# Altium schematic sheet obc-v2_BOARD-CONNECT.SchDoc
size 420 x 297 mm; SheetNumber: 8; SheetTotal: 21
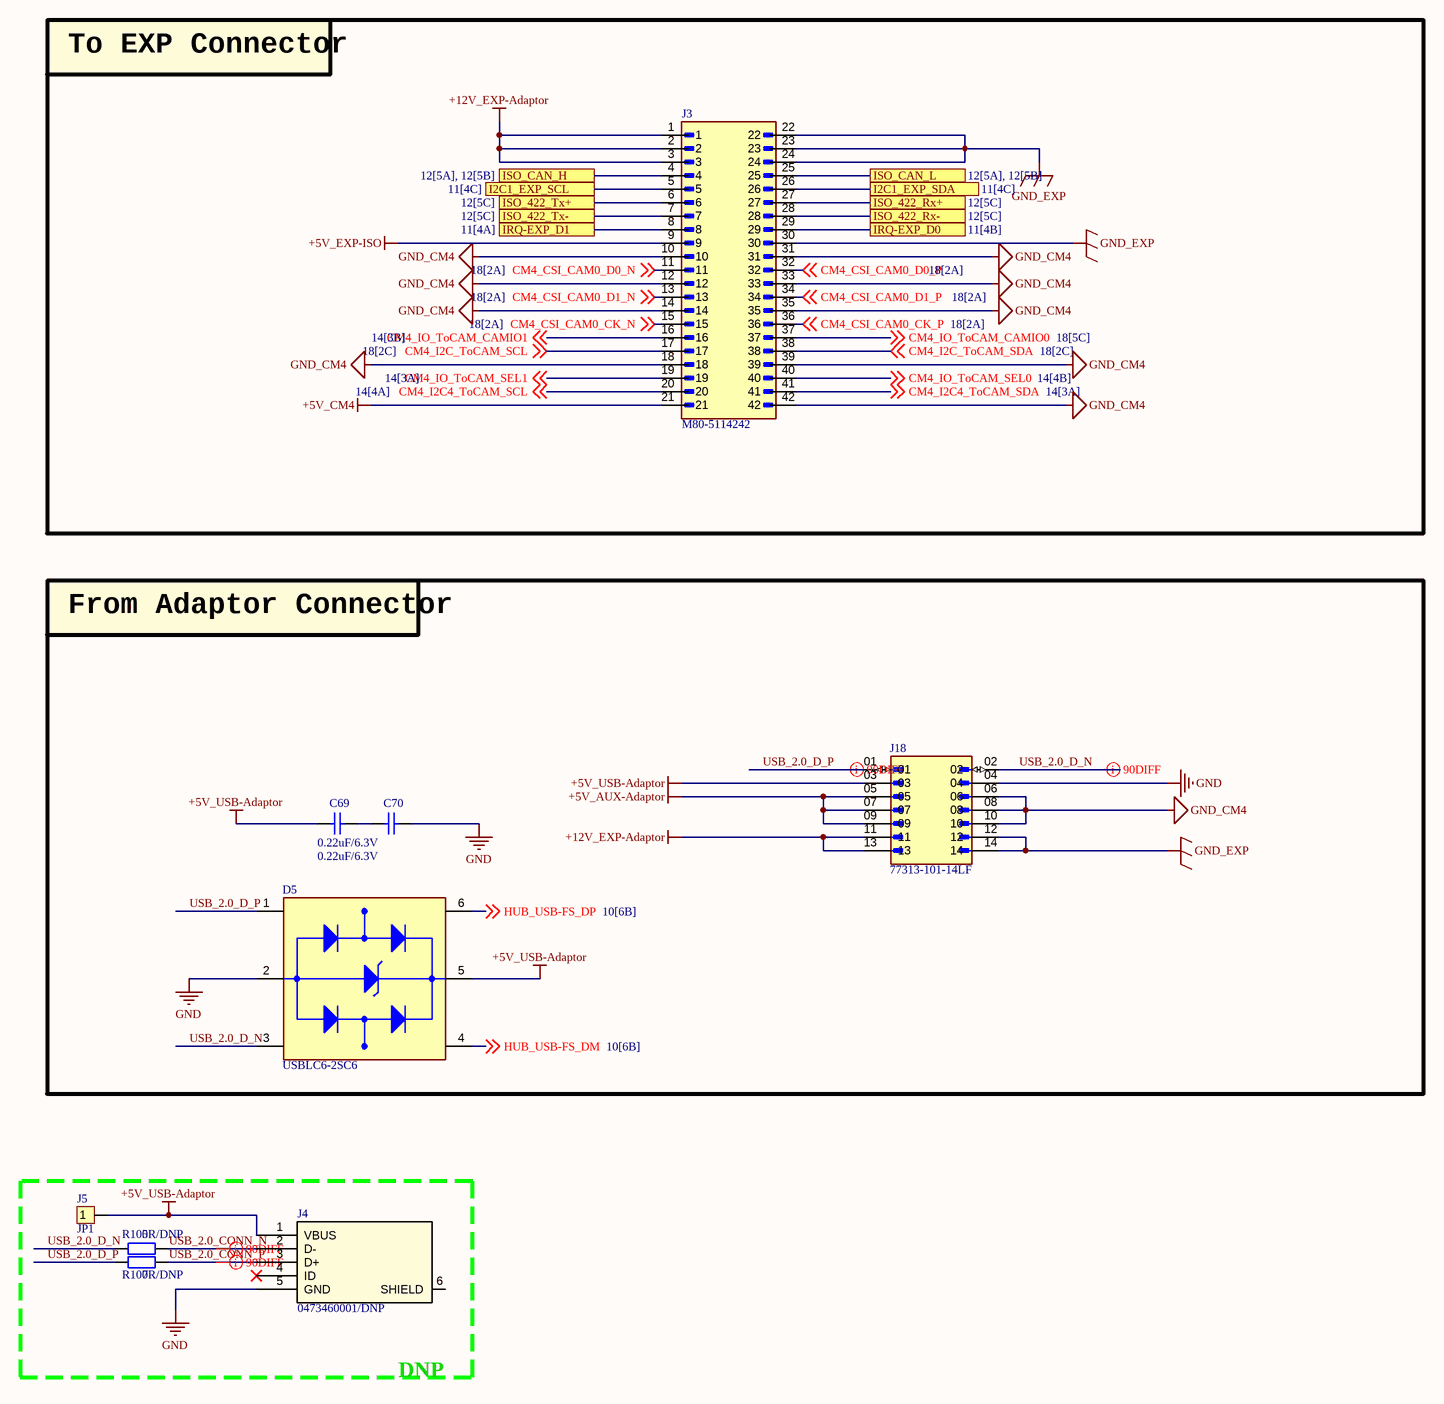
[diagram p0: obc-v2_BOARD-CONNECT.SchDoc]

## Parts
C69  0.22uF/6.3V  [CAP_C_1005X60]
C70  0.22uF/6.3V  [CAP_C_1005X60]
D5  USBLC6-2SC6  [SOT95P280X145-6N]
J3  M80-5114242  [HARWIN_M80-5114242]
J4  0473460001/DNP  [47346-0001_MOL]
J5  JP1  [JP1-D1T]
J18  77313-101-14LF  [AMPHENOL_77313-101-14LF]
R105  0R/DNP  [RES_C_1608X60]
R107  0R/DNP  [RES_C_1608X60]

## Blocks framed on the sheet
To EXP Connector: J3
From Adaptor Connector: C69 C70 D5 J18

## Ports
I2C1_EXP_SCL (see 11[4C]), I2C1_EXP_SDA (see 11[4C]), IRQ-EXP_D0 (see 11[4B]), IRQ-EXP_D1 (see 11[4A]), ISO_422_Rx+ (see 12[5C]), ISO_422_Rx- (see 12[5C]), ISO_422_Tx+ (see 12[5C]), ISO_422_Tx- (see 12[5C]), ISO_CAN_H (see 12[5A], 12[5B]), ISO_CAN_L (see 12[5A], 12[5B])

## Nets
+5V_AUX-Adaptor: J18.05 J18.07 J18.09
+5V_CM4: J3.21
+5V_EXP-ISO: J3.9
+5V_USB-Adaptor: C69.2 D5.5(VBUS) J4.1(VBUS) J5.1 J18.03
+12V_EXP-Adaptor: J3.1 J3.2 J3.3 J18.11 J18.13
GND: C70.1 D5.2(GND) J4.5(GND) J18.04
GND_CM4: J3.10 J3.12 J3.14 J3.18 J3.31 J3.33 J3.35 J3.39 J3.42 J18.06 J18.08 J18.10
GND_EXP: J3.22 J3.23 J3.24 J3.30 J18.12 J18.14
CM4_CSI_CAM0_CK_N: J3.15 ; off-sheet CM4_CSI_CAM0_CK_N
CM4_CSI_CAM0_CK_P: J3.36 ; off-sheet CM4_CSI_CAM0_CK_P
CM4_CSI_CAM0_D0_N: J3.11 ; off-sheet CM4_CSI_CAM0_D0_N
CM4_CSI_CAM0_D0_P: J3.32 ; off-sheet CM4_CSI_CAM0_D0_P
CM4_CSI_CAM0_D1_N: J3.13 ; off-sheet CM4_CSI_CAM0_D1_N
CM4_CSI_CAM0_D1_P: J3.34 ; off-sheet CM4_CSI_CAM0_D1_P
CM4_I2C4_ToCAM_SCL: J3.20 ; off-sheet CM4_I2C4_ToCAM_SCL
CM4_I2C4_ToCAM_SDA: J3.41 ; off-sheet CM4_I2C4_ToCAM_SDA
CM4_I2C_ToCAM_SCL: J3.17 ; off-sheet CM4_I2C_ToCAM_SCL
CM4_I2C_ToCAM_SDA: J3.38 ; off-sheet CM4_I2C_ToCAM_SDA
CM4_IO_ToCAM_CAMIO0: J3.37 ; off-sheet CM4_IO_ToCAM_CAMIO0
CM4_IO_ToCAM_CAMIO1: J3.16 ; off-sheet CM4_IO_ToCAM_CAMIO1
CM4_IO_ToCAM_SEL0: J3.40 ; off-sheet CM4_IO_ToCAM_SEL0
CM4_IO_ToCAM_SEL1: J3.19 ; off-sheet CM4_IO_ToCAM_SEL1
HUB_USB-FS_DM: D5.4(I/O2_OUT) ; off-sheet HUB_USB-FS_DM
HUB_USB-FS_DP: D5.6(I/O1_OUT) ; off-sheet HUB_USB-FS_DP
I2C1_EXP_SCL: J3.5 ; port I2C1_EXP_SCL
I2C1_EXP_SDA: J3.26 ; port I2C1_EXP_SDA
IRQ-EXP_D0: J3.29 ; port IRQ-EXP_D0
IRQ-EXP_D1: J3.8 ; port IRQ-EXP_D1
ISO_422_Rx+: J3.27 ; port ISO_422_Rx+
ISO_422_Rx-: J3.28 ; port ISO_422_Rx-
ISO_422_Tx+: J3.6 ; port ISO_422_Tx+
ISO_422_Tx-: J3.7 ; port ISO_422_Tx-
ISO_CAN_H: J3.4 ; port ISO_CAN_H
ISO_CAN_L: J3.25 ; port ISO_CAN_L
USB_2.0_CONN_N: J4.2(D-) R105.1
USB_2.0_CONN_P: J4.3(D+) R107.1
USB_2.0_D_N: D5.3(I/O2_IN) J18.02 R105.2
USB_2.0_D_P: D5.1(I/O1_IN) J18.01 R107.2
NetC69_1: C69.1 C70.2

Not connected (* = marked no-connect by the designer): J4 4(ID)* 6(SHIELD)

## Layout directives
differential pair; differential pair class DIFF90: USB_2.0_CONN_N, USB_2.0_CONN_P, USB_2.0_D_N, USB_2.0_D_P

## Notes on the sheet
- DNP
- Project:
- Sub-system:
- Design by:
- Sheet title:
- Sheet
- A3
- of
- Checked by:
- Approved by:
- Revision:
- Document No:
- Size:
- Date:

## Library data of the parts
C69 C70 = Tu 0402 33nF 10V: CAPC; Chung_Loai: Dán; Don_Vi: Con; So_Chan: 2; Ten_Linh_Kien: Tụ 0402 33nF X7R 10V GRM155R71A333KA01D; Ma_Hang: MH007853; Kieu_Chan: *
D5 = USBLC6-2SC6: 17V Clamp 5A (8/20Âµs) Ipp Tvs Diode Surface Mount SOT-23-6; MF: STMicroelectronics; Value: *; SnapEDA_Link: https://www.snapeda.com/parts/USBLC6-2SC6/STMicroelectronics/view-part/?ref=snap; Check_prices: https://www.snapeda.com/parts/USBLC6-2SC6/STMicroelectronics/view-part/?ref=eda; Purchase-URL: https://pricing.snapeda.com/search/part/USBLC6-2SC6/?ref=eda; Price: None; Availability: In Stock; Package: SOT-23-6 STMicroelectronics; MP: USBLC6-2SC6
J4 = USB_micro: No Description Available; Mfr_Name: Molex Connector Corporation; RefDes: RefDes; Type: Type
J5 = JP1: WR-PHD 2.54 mm Angled Socket Header; Manufacturer: W¨¹rth Elektronik eiSos GmbH; partNo: 613002143121; ComponentLink1 Description: Manufacturer; ComponentLink2 Description: Datasheet; NoPins: 02; Created Date: 29 March 2013; ComponentLink1URL: http://www.we-online.com; ComponentLink2URL: http://katalog.we-online.de/em/datasheet/6130xx143121.pdf; Created by: Karrer Zheng
J18 = 77313-101-14LF: MF: AMPHENOL ICC / FCI; Package: None; Price: None; Value: *; MP: 77313-101-14LF; Availability: Unavailable
R105 R107 = Tro 0603 1% 1k: RES SMD 12K OHM 1% 1/10W 0603, P/N: ERJ-3EKF1202V; Chung_Loai: Dán; So_Chan: 2; Don_Vi: Con; Ten_Linh_Kien: Trở 0603 1% 1k; Ma_Hang: MH006334; Kieu_Chan: *
J3 = M80-5114242: Package: None; Price: None; Value: *; MP: M80-5114242; Availability: Unavailable